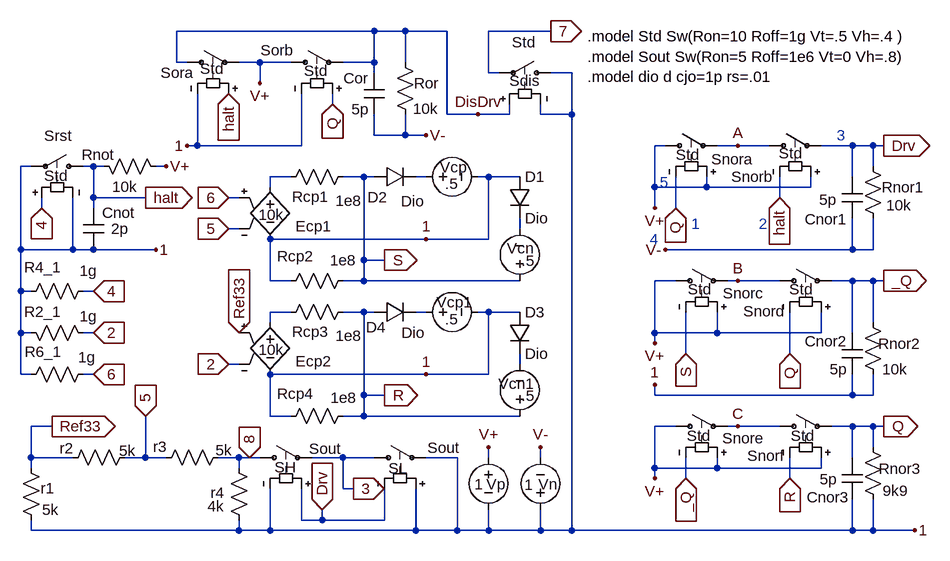
[diagram p0: schematic 555bcn.asc]
555bcn.asc, the LTspice schematic file:
Version 4
SHEET 1 1424 796
WIRE -64 -144 -368 -144
WIRE -16 -144 -64 -144
WIRE 48 -144 -16 -144
WIRE 208 -144 112 -144
WIRE -368 -96 -368 -144
WIRE -352 -96 -368 -96
WIRE -240 -96 -272 -96
WIRE -192 -96 -240 -96
WIRE -64 -96 -64 -144
WIRE -64 -96 -112 -96
WIRE -16 -96 -16 -144
WIRE -64 -80 -64 -96
WIRE 112 -80 112 -144
WIRE 128 -80 112 -80
WIRE 240 -80 208 -80
WIRE -240 -64 -240 -96
WIRE -128 -32 -128 -48
WIRE 48 -16 48 -144
WIRE 96 -16 48 -16
WIRE 144 -16 144 -32
WIRE 144 -16 96 -16
WIRE 192 -16 192 -32
WIRE 240 -16 240 -80
WIRE 240 -16 192 -16
WIRE -64 16 -64 -16
WIRE -16 16 -16 -16
WIRE -16 16 -64 16
WIRE 16 16 -16 16
WIRE -336 32 -336 -48
WIRE -336 32 -352 32
WIRE -176 32 -176 -48
WIRE -176 32 -336 32
WIRE 384 32 368 32
WIRE 496 32 464 32
WIRE 544 32 496 32
WIRE 672 32 624 32
WIRE 704 32 672 32
WIRE 720 32 704 32
WIRE -592 64 -608 64
WIRE -496 64 -512 64
WIRE -480 64 -496 64
WIRE -384 64 -400 64
WIRE 704 64 704 32
WIRE -192 80 -224 80
WIRE -80 80 -112 80
WIRE -64 80 -80 80
WIRE 16 80 0 80
WIRE 112 80 96 80
WIRE 160 80 112 80
WIRE 672 80 672 32
WIRE -224 96 -224 80
WIRE 368 96 368 32
WIRE 448 96 448 80
WIRE 448 96 368 96
WIRE 608 96 608 80
WIRE 608 96 448 96
WIRE -496 112 -496 64
WIRE -416 112 -496 112
WIRE -272 112 -288 112
WIRE 560 112 560 80
WIRE -576 128 -576 112
WIRE -496 128 -496 112
WIRE 368 128 368 96
WIRE 400 128 400 80
WIRE -272 160 -288 160
WIRE 160 160 160 144
WIRE 16 176 -224 176
WIRE 112 176 112 80
WIRE 112 176 16 176
WIRE -608 192 -608 64
WIRE -528 192 -528 112
WIRE -528 192 -608 192
WIRE -496 192 -528 192
WIRE -400 192 -496 192
WIRE 672 192 672 144
WIRE 672 192 384 192
WIRE 704 192 704 144
WIRE 704 192 672 192
WIRE -80 208 -80 80
WIRE -48 208 -80 208
WIRE -224 240 -224 176
WIRE -192 240 -224 240
WIRE -80 240 -80 208
WIRE -80 240 -112 240
WIRE 160 240 -80 240
WIRE 400 240 368 240
WIRE 496 240 480 240
WIRE 560 240 496 240
WIRE 672 240 640 240
WIRE 704 240 672 240
WIRE 720 240 704 240
WIRE -608 256 -608 192
WIRE -592 256 -608 256
WIRE -496 256 -512 256
WIRE -192 288 -224 288
WIRE -80 288 -112 288
WIRE -64 288 -80 288
WIRE 16 288 0 288
WIRE 112 288 96 288
WIRE 160 288 112 288
WIRE -224 304 -224 288
WIRE 704 304 704 240
WIRE -608 320 -608 256
WIRE -592 320 -608 320
WIRE -496 320 -512 320
WIRE 368 320 368 240
WIRE 464 320 464 288
WIRE 464 320 368 320
WIRE 624 320 624 288
WIRE 624 320 464 320
WIRE 672 320 672 240
WIRE 368 336 368 320
WIRE 416 352 416 288
WIRE 576 352 576 288
WIRE -272 368 -288 368
WIRE 160 368 160 352
WIRE -608 384 -608 320
WIRE -592 384 -608 384
WIRE -496 384 -512 384
WIRE 16 384 -224 384
WIRE 112 384 112 288
WIRE 112 384 16 384
WIRE -80 416 -80 288
WIRE -48 416 -80 416
WIRE 368 416 368 400
WIRE 672 416 672 384
WIRE 672 416 368 416
WIRE 704 416 704 384
WIRE 704 416 672 416
WIRE -224 448 -224 384
WIRE -192 448 -224 448
WIRE -80 448 -80 416
WIRE -80 448 -112 448
WIRE 160 448 -80 448
WIRE -560 464 -592 464
WIRE 400 464 368 464
WIRE 496 464 480 464
WIRE 560 464 496 464
WIRE 672 464 640 464
WIRE 704 464 672 464
WIRE 720 464 704 464
WIRE 704 496 704 464
WIRE -592 512 -592 464
WIRE -528 512 -592 512
WIRE -416 512 -416 448
WIRE -416 512 -448 512
WIRE -384 512 -416 512
WIRE -272 512 -304 512
WIRE -256 512 -272 512
WIRE -240 512 -256 512
WIRE -112 512 -160 512
WIRE -64 512 -112 512
WIRE 64 512 16 512
WIRE 112 512 112 496
WIRE 192 512 192 496
WIRE 672 512 672 464
WIRE -592 528 -592 512
WIRE -272 528 -272 512
WIRE 368 528 368 464
WIRE 464 528 464 512
WIRE 464 528 368 528
WIRE 624 528 624 512
WIRE 624 528 464 528
WIRE 368 544 368 528
WIRE 416 544 416 512
WIRE 576 544 576 512
WIRE -112 560 -112 512
WIRE -96 560 -112 560
WIRE -176 608 -176 560
WIRE -144 608 -144 592
WIRE -144 608 -176 608
WIRE -48 608 -48 560
WIRE -48 608 -144 608
WIRE -592 624 -592 608
WIRE -272 624 -272 608
WIRE -272 624 -592 624
WIRE -224 624 -224 560
WIRE -224 624 -272 624
WIRE 0 624 0 560
WIRE 0 624 -224 624
WIRE 64 624 64 512
WIRE 64 624 0 624
WIRE 112 624 112 592
WIRE 112 624 64 624
WIRE 192 624 192 592
WIRE 192 624 112 624
WIRE 240 624 240 -16
WIRE 240 624 192 624
WIRE 672 624 672 576
WIRE 672 624 240 624
WIRE 704 624 704 576
WIRE 704 624 672 624
WIRE 768 624 704 624
FLAG -560 464 Ref33
IOPIN -560 464 Out
FLAG -416 448 5
IOPIN -416 448 In
FLAG 208 -144 7
IOPIN 208 -144 Out
FLAG 96 -16 DisDrv
FLAG -256 512 8
IOPIN -256 512 In
FLAG -96 560 3
IOPIN -96 560 Out
FLAG -144 592 Drv
IOPIN -144 592 In
FLAG 768 624 1
FLAG -496 256 4
IOPIN -496 256 In
FLAG 192 496 V-
FLAG 112 496 V+
FLAG -496 320 2
IOPIN -496 320 In
FLAG -416 112 halt
IOPIN -416 112 Out
FLAG -576 128 4
IOPIN -576 128 In
FLAG -400 192 1
FLAG -384 64 V+
FLAG 720 32 Drv
IOPIN 720 32 Out
FLAG 400 128 Q
IOPIN 400 128 In
FLAG 560 112 halt
IOPIN 560 112 In
FLAG 384 192 V-
FLAG 368 128 V+
FLAG 720 240 _Q
IOPIN 720 240 Out
FLAG 416 352 S
IOPIN 416 352 In
FLAG 576 352 Q
IOPIN 576 352 In
FLAG 368 400 1
FLAG 368 336 V+
FLAG 720 464 Q
IOPIN 720 464 Out
FLAG 416 544 _Q
IOPIN 416 544 In
FLAG 576 544 R
IOPIN 576 544 In
FLAG 368 544 V+
FLAG -288 -48 halt
IOPIN -288 -48 In
FLAG -128 -32 Q
IOPIN -128 -32 In
FLAG 16 16 V-
FLAG -240 -64 V+
FLAG 496 32 A
FLAG 496 240 B
FLAG 496 464 C
FLAG -352 32 1
FLAG -288 112 6
IOPIN -288 112 In
FLAG -288 160 5
IOPIN -288 160 In
FLAG 16 176 1
FLAG -48 208 S
IOPIN -48 208 Out
FLAG -272 320 Ref33
IOPIN -272 320 In
FLAG -288 368 2
IOPIN -288 368 In
FLAG 16 384 1
FLAG -48 416 R
IOPIN -48 416 Out
FLAG -496 384 6
IOPIN -496 384 In
SYMBOL res -608 512 R0
WINDOW 0 31 47 Left 0
WINDOW 3 33 80 Left 0
SYMATTR InstName r1
SYMATTR Value 5k
SYMBOL res -432 496 R90
WINDOW 0 17 105 VBottom 0
WINDOW 3 -10 12 VTop 0
SYMATTR InstName r2
SYMATTR Value 5k
SYMBOL res -288 496 R90
WINDOW 0 15 105 VBottom 0
WINDOW 3 -11 7 VTop 0
SYMATTR InstName r3
SYMATTR Value 5k
SYMBOL sw 224 -80 M270
WINDOW 0 -12 33 VRight 0
WINDOW 3 47 40 VRight 0
SYMATTR InstName Sdis
SYMATTR Value Std
SYMBOL sw -256 512 R270
WINDOW 0 -15 39 VRight 0
WINDOW 3 14 92 VRight 0
SYMATTR InstName SH
SYMATTR Value Sout
SYMBOL sw -80 512 R270
WINDOW 0 -16 38 VRight 0
WINDOW 3 15 98 VRight 0
SYMATTR InstName SL
SYMATTR Value Sout
SYMBOL res -256 624 R180
WINDOW 0 38 58 Left 0
WINDOW 3 39 37 Left 0
SYMATTR InstName r4
SYMATTR Value 4k
SYMBOL voltage 112 496 R0
WINDOW 0 -3 57 Left 0
WINDOW 3 -22 57 Left 0
SYMATTR InstName Vp
SYMATTR Value 1
SYMBOL voltage 192 608 R180
WINDOW 0 -26 55 Left 0
WINDOW 3 11 54 Left 0
SYMATTR InstName Vn
SYMATTR Value 1
SYMBOL res -496 336 M270
WINDOW 0 33 78 VTop 0
WINDOW 3 57 8 VBottom 0
SYMATTR InstName R2_1
SYMATTR Value 1g
SYMBOL sw -496 64 M270
WINDOW 0 47 33 VRight 0
WINDOW 3 -14 76 VLeft 0
SYMATTR InstName Srst
SYMATTR Value Std
SYMBOL res -496 48 M90
WINDOW 0 14 7 VBottom 0
WINDOW 3 32 48 VTop 0
SYMATTR InstName Rnot
SYMATTR Value 10k
SYMBOL sw 368 32 R270
WINDOW 0 -21 87 VRight 0
WINDOW 3 -14 32 VRight 0
SYMATTR InstName Snora
SYMATTR Value Std
SYMBOL sw 528 32 R270
WINDOW 0 -48 -42 VRight 0
WINDOW 3 -12 31 VRight 0
SYMATTR InstName Snorb
SYMATTR Value Std
SYMBOL sw 384 240 R270
WINDOW 0 -19 89 VRight 0
WINDOW 3 -13 35 VRight 0
SYMATTR InstName Snorc
SYMATTR Value Std
SYMBOL sw 544 240 R270
WINDOW 0 -47 -40 VRight 0
WINDOW 3 -13 31 VRight 0
SYMATTR InstName Snord
SYMATTR Value Std
SYMBOL sw 384 464 R270
WINDOW 0 -18 88 VRight 0
WINDOW 3 -14 33 VRight 0
SYMATTR InstName Snore
SYMATTR Value Std
SYMBOL sw 544 464 R270
WINDOW 0 -45 -34 VRight 0
WINDOW 3 -14 33 VRight 0
SYMATTR InstName Snorf
SYMATTR Value Std
SYMBOL sw -368 -96 R270
WINDOW 0 -16 -25 VRight 0
WINDOW 3 -10 36 VRight 0
SYMATTR InstName Sora
SYMATTR Value Std
SYMBOL sw -208 -96 R270
WINDOW 0 19 -31 VRight 0
WINDOW 3 -13 36 VRight 0
SYMATTR InstName Sorb
SYMATTR Value Std
SYMBOL res -32 -112 R0
WINDOW 0 29 48 Left 0
WINDOW 3 28 87 Left 0
SYMATTR InstName Ror
SYMATTR Value 10k
SYMBOL res 688 48 R0
WINDOW 0 29 48 Left 0
SYMATTR InstName Rnor1
SYMATTR Value 10k
SYMBOL res 688 288 R0
WINDOW 0 24 49 Left 0
WINDOW 3 30 88 Left 0
SYMATTR InstName Rnor2
SYMATTR Value 10k
SYMBOL res 688 480 R0
WINDOW 0 25 49 Left 0
WINDOW 3 31 83 Left 0
SYMATTR InstName Rnor3
SYMATTR Value 9k9
SYMBOL cap -48 -80 M0
SYMATTR InstName Cor
SYMATTR Value 5p
SYMBOL cap -512 128 R0
WINDOW 0 29 7 Left 0
WINDOW 3 43 32 Left 0
SYMATTR InstName Cnot
SYMATTR Value 2p
SYMBOL cap 688 80 M0
WINDOW 0 23 65 Left 0
WINDOW 3 40 35 Left 0
SYMATTR InstName Cnor1
SYMATTR Value 5p
SYMBOL cap 688 320 M0
WINDOW 0 23 13 Left 0
SYMATTR InstName Cnor2
SYMATTR Value 5p
SYMBOL cap 688 512 M0
WINDOW 0 20 61 Left 0
WINDOW 3 39 33 Left 0
SYMATTR InstName Cnor3
SYMATTR Value 5p
SYMBOL res -496 240 R90
WINDOW 0 -5 78 VBottom 0
WINDOW 3 -31 8 VTop 0
SYMATTR InstName R4_1
SYMATTR Value 1g
SYMBOL res -496 368 R90
WINDOW 0 -3 77 VBottom 0
WINDOW 3 -26 10 VTop 0
SYMATTR InstName R6_1
SYMATTR Value 1g
SYMBOL e -224 80 R0
WINDOW 0 39 76 Left 0
WINDOW 3 -18 58 Left 0
SYMATTR InstName Ecp1
SYMATTR Value 10k
SYMBOL res -96 64 R90
WINDOW 0 62 66 VBottom 0
WINDOW 3 37 7 VTop 0
SYMATTR InstName Rcp1
SYMATTR Value 1e8
SYMBOL res -96 224 R90
WINDOW 0 -6 89 VBottom 0
WINDOW 3 -31 16 VTop 0
SYMATTR InstName Rcp2
SYMATTR Value 1e8
SYMBOL diode 144 80 R0
SYMATTR InstName D1
SYMATTR Value Dio
SYMBOL voltage 160 256 R180
WINDOW 0 -22 66 Left 0
WINDOW 3 -23 47 Left 0
WINDOW 123 0 0 Left 0
WINDOW 39 0 0 Left 0
SYMATTR InstName Vcn
SYMATTR Value .5
SYMBOL diode -64 96 R270
WINDOW 0 -31 5 VTop 0
WINDOW 3 -6 59 VBottom 0
SYMATTR InstName D2
SYMATTR Value Dio
SYMBOL voltage 0 80 R270
WINDOW 0 15 37 VRight 0
WINDOW 3 -11 45 VRight 0
WINDOW 123 0 0 Left 0
WINDOW 39 0 0 Left 0
SYMATTR InstName Vcp
SYMATTR Value .5
SYMBOL e -224 288 R0
WINDOW 0 39 76 Left 0
WINDOW 3 -18 58 Left 0
SYMATTR InstName Ecp2
SYMATTR Value 10k
SYMBOL res -96 272 R90
WINDOW 0 62 66 VBottom 0
WINDOW 3 37 7 VTop 0
SYMATTR InstName Rcp3
SYMATTR Value 1e8
SYMBOL res -96 432 R90
WINDOW 0 -3 89 VBottom 0
WINDOW 3 -28 15 VTop 0
SYMATTR InstName Rcp4
SYMATTR Value 1e8
SYMBOL diode 144 288 R0
SYMATTR InstName D3
SYMATTR Value Dio
SYMBOL voltage 160 464 R180
WINDOW 0 -22 66 Left 0
WINDOW 3 -23 47 Left 0
WINDOW 123 0 0 Left 0
WINDOW 39 0 0 Left 0
SYMATTR InstName Vcn1
SYMATTR Value .5
SYMBOL diode -64 304 R270
WINDOW 0 -23 3 VTop 0
WINDOW 3 0 60 VBottom 0
SYMATTR InstName D4
SYMATTR Value Dio
SYMBOL voltage 0 288 R270
WINDOW 0 15 32 VRight 0
WINDOW 3 -11 45 VRight 0
WINDOW 123 0 0 Left 0
WINDOW 39 0 0 Left 0
SYMATTR InstName Vcp1
SYMATTR Value .5
TEXT 424 152 Left 0 ;1
TEXT 528 152 Left 0 ;2
TEXT 376 88 Left 0 ;5
TEXT 648 16 Left 0 ;3
TEXT 360 176 Left 0 ;4
TEXT 264 -136 Left 0 !.model Std Sw(Ron=10 Roff=1g Vt=.5 Vh=.4 )\n.model Sout Sw(Ron=5 Roff=1e6 Vt=0 Vh=.8)\n.model dio d cjo=1p rs=.01

The netlist it stands for:
* 555bcn.asc
r1 Ref33 1 5k
r2 5 Ref33 5k
r3 8 5 5k
Sdis 1 7 DisDrv 1 Std
SH 8 3 Drv 1 Sout
SL 3 1 1 Drv Sout
r4 1 8 4k
Vp V+ 1 1
Vn 1 V- 1
R2_1 2 1 1g
Srst halt 1 4 1 Std
Rnot halt V+ 10k
Snora V+ A V+ Q Std
Snorb A Drv V+ halt Std
Snorc V+ B V+ S Std
Snord B _Q V+ Q Std
Snore V+ C V+ _Q Std
Snorf C Q V+ R Std
Sora DisDrv V+ halt 1 Std
Sorb V+ DisDrv Q 1 Std
Ror DisDrv V- 10k
Rnor1 Drv V- 10k
Rnor2 _Q 1 10k
Rnor3 Q 1 9k9
Cor DisDrv V- 5p
Cnot halt 1 2p
Cnor1 Drv V- 5p
Cnor2 _Q 1 5p
Cnor3 Q 1 5p
R4_1 4 1 1g
R6_1 6 1 1g
Ecp1 N001 1 6 5 10k
Rcp1 S N001 1e8
Rcp2 S 1 1e8
D1 1 N003 Dio
Vcn S N003 .5
D2 S N002 Dio
Vcp N002 1 .5
Ecp2 N004 1 Ref33 2 10k
Rcp3 R N004 1e8
Rcp4 R 1 1e8
D3 1 N006 Dio
Vcn1 R N006 .5
D4 R N005 Dio
Vcp1 N005 1 .5
.model D D
.lib standard.dio
* 1
* 2
* 5
* 3
* 4
.model Std Sw(Ron=10 Roff=1g Vt=.5 Vh=.4 )
.model Sout Sw(Ron=5 Roff=1e6 Vt=0 Vh=.8)
.model dio d cjo=1p rs=.01
.backanno
.end